# EAGLE design mq-4-v0.2 (EAGLE 7.6.0)
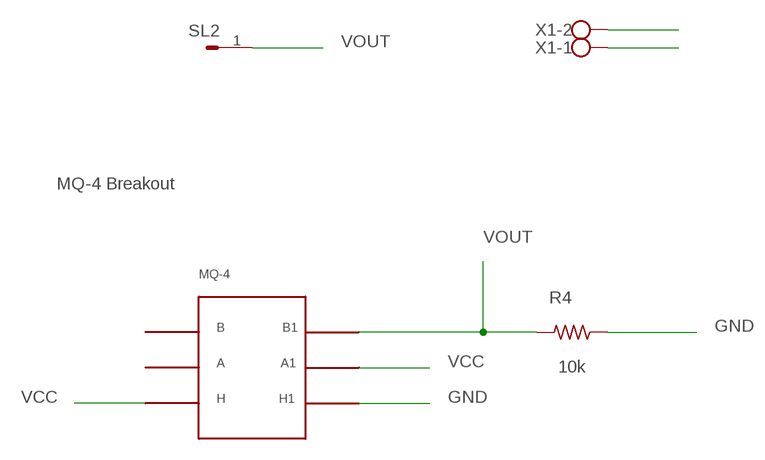
[diagram p0: schematic, sheet 1]

## Parts
R4  10k  R-US_0207/10  [0207/10]
SL2  M0201P  [02P]
U$1  MQ-4  [MQ-4]
X1  W237-102  [W237-102]

## Nets
GND [GND]: R4.1 U$1.H1 X1.2
VCC: U$1.A1 U$1.H X1.1
VOUT: R4.2 SL2.1 U$1.B1
Unconnected: U$1.A U$1.B

## Notes on the sheet
- MQ-4 Breakout

## Library data of the parts
R4 = rcl:R-US_: RESISTOR, American symbol
SL2 = pads:M02: AMP QUICK CONNECTOR
U$1 = mq-x:MQ-4
X1 = con-wago-500:W237-102: WAGO SCREW CLAMP; MPN: 237-102; OC_FARNELL: unknown; OC_NEWARK: 70K9898

## Net classes
0 default: width 0.914 mm, drill 0.254 mm, clearance 0.508 mm
1 GND: width 0.914 mm, drill 0.254 mm, clearance 0.508 mm

## Board
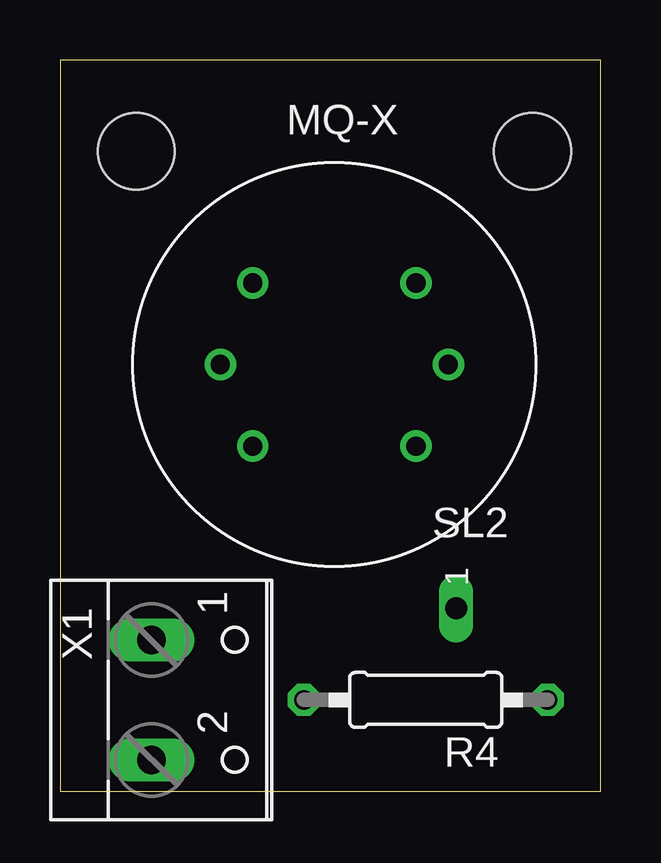
[diagram p1: board, top side]
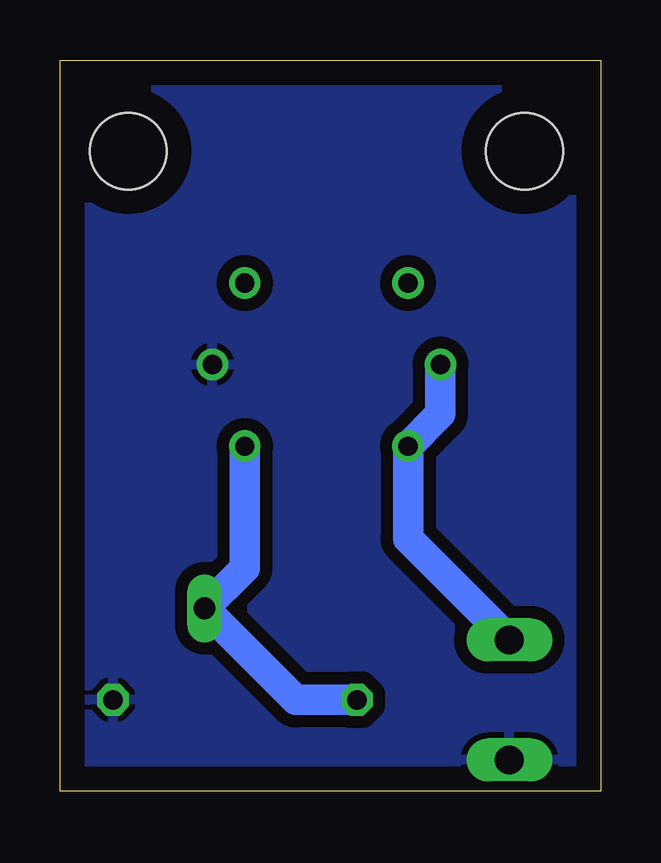
[diagram p2: board, bottom side, seen from below]

Size 22.53 x 30.47 mm. Coordinates in mm from the lower left corner, seen from the top.
Outline: 0,0 22.53,0 22.53,30.47 0,30.47 0,0
Copper layers (1*16): Top 0.035mm / dielectric 1.5mm / Bottom 0.035mm
Design rules "mq-4": minimum track width 10mil, minimum drill 24mil, track to track 0.205mm, track to pad 0.205mm, pad to pad 0.205mm, via to via 0.205mm, smd to smd 8mil, copper to edge 40mil, drill to drill 8mil, minimum pad ring 10mil, minimum via ring 8mil, stop-mask expansion 4mil, vias tented up to drill 0mil, thermal gap 10mil
Holes 3.2 mm at 3.17,26.67 19.68,26.67

### Footprints (pad centres in the part's own frame; a part is rotated, then mirrored left to right if it is on the bottom)
0207/10 = drill 0.813 octagon: 1 -5.08,0; 2 5.08,0
02P = drill 0.914 long: 1 -1.27,0
MQ-4 = drill 0.8: A -3.4,3.4; A1 -3.4,-3.4; B 3.4,3.4; B1 3.4,-3.4; H -4.75,0; H1 4.75,0
W237-102 = drill 1.194 long: 1 -2.5,-1.27; 2 2.5,-1.27

### Placement (x,y rotation side)
R4  15.24,3.81 180 top
SL2  17.78,7.62 0 top
U$1  11.43,17.78 0 top
X1  5.08,3.81 270 top

### Tracks (layer width: path | path; a pad name or v marks a point on that pad's centre or on a via)
GND
  pour Bottom: 0,-1.27 0,30.48 22.86,30.48 22.86,-1.27
VCC
  Bottom 1.27: U$1.H 6.68,15.73 U$1.A1 8.03,10.53 X1.1
VOUT
  Bottom 1.27: U$1.B1 14.83,9.3 SL2.1 12.7,3.81 R4.2